# Altium schematic sheet SpiMux.SchDoc
size A4; DocumentNumber: 7; SheetNumber: 7; SheetTotal: 15
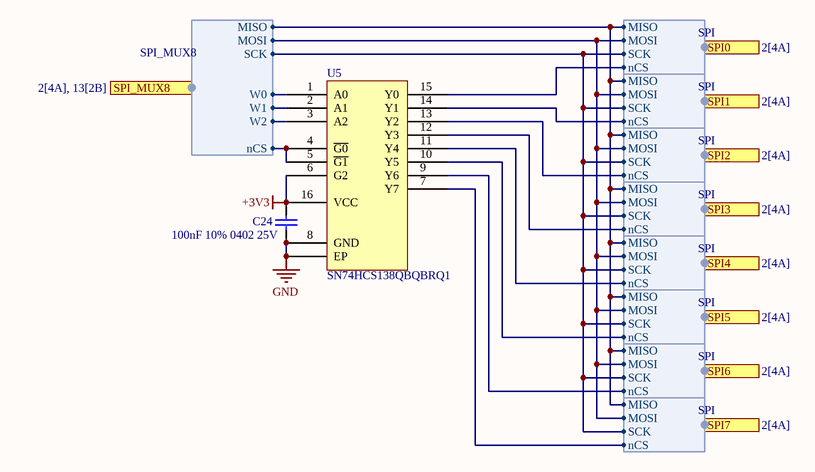
[diagram p0: SpiMux.SchDoc]

## Parts
C24  100nF 10% 0402 25V  [0402N]
U5  SN74HCS138QBQBRQ1  [SN74HCS138QBQBRQ1-Footprint-1]

## Ports
SPI0 (harness SPI, see 2[4A]), SPI1 (harness SPI, see 2[4A]), SPI2 (harness SPI, see 2[4A]), SPI3 (harness SPI, see 2[4A]), SPI4 (harness SPI, see 2[4A]), SPI5 (harness SPI, see 2[4A]), SPI6 (harness SPI, see 2[4A]), SPI7 (harness SPI, see 2[4A]), SPI_MUX8 (harness SPI_MUX8, see 2[4A], 13[2B])

## Harnesses
SPI_MUX8: nCS, SCK, MISO, MOSI, W0, W1, W2
SPI: nCS, SCK, MISO, MOSI

## Nets
+3V3: C24.2 U5.6(G2) U5.16(VCC)
GND: C24.1 U5.8(GND) U5.17(EP)
NetU5_1: U5.1(A0) ; port SPI_MUX8.W0
NetU5_2: U5.2(A1) ; port SPI_MUX8.W1
NetU5_3: U5.3(A2) ; port SPI_MUX8.W2
NetU5_4: U5.4(~{G0}) U5.5(~{G1}) ; port SPI_MUX8.nCS
NetU5_7: U5.7(Y7) ; port SPI7.nCS
NetU5_9: U5.9(Y6) ; port SPI6.nCS
NetU5_10: U5.10(Y5) ; port SPI5.nCS
NetU5_11: U5.11(Y4) ; port SPI4.nCS
NetU5_12: U5.12(Y3) ; port SPI3.nCS
NetU5_13: U5.13(Y2) ; port SPI2.nCS
NetU5_14: U5.14(Y1) ; port SPI1.nCS
NetU5_15: U5.15(Y0) ; port SPI0.nCS
(unnamed): port SPI_MUX8.SCK, port SPI0.SCK, port SPI1.SCK, port SPI2.SCK, port SPI3.SCK, port SPI4.SCK, port SPI5.SCK, port SPI6.SCK, port SPI7.SCK
(unnamed): port SPI_MUX8.MISO, port SPI0.MISO, port SPI1.MISO, port SPI2.MISO, port SPI3.MISO, port SPI4.MISO, port SPI5.MISO, port SPI6.MISO, port SPI7.MISO
(unnamed): port SPI_MUX8.MOSI, port SPI0.MOSI, port SPI1.MOSI, port SPI2.MOSI, port SPI3.MOSI, port SPI4.MOSI, port SPI5.MOSI, port SPI6.MOSI, port SPI7.MOSI

## Library data of the parts
C24 = C0402: Capacitance: 100n; Tolerance: 10; Voltage: 25; Footprint: 0402
U5 = CMP-016-00012-1: Automotive 3-line to 8-line decoders/demultiplexer 16-WQFN -40 to 125